# EasyEDA Pro project 单轴带屏幕.eprj, schematic 原理图
Board Name: 南塘; Create Date: 2024-04-22; Page Name: 主控MCU; Project Name: 单轴带屏幕; Schematic Name: 原理图; Update Date: 2025-10-31; Company: 嘉立创EDA; Page Size: A3; Version: V1.0
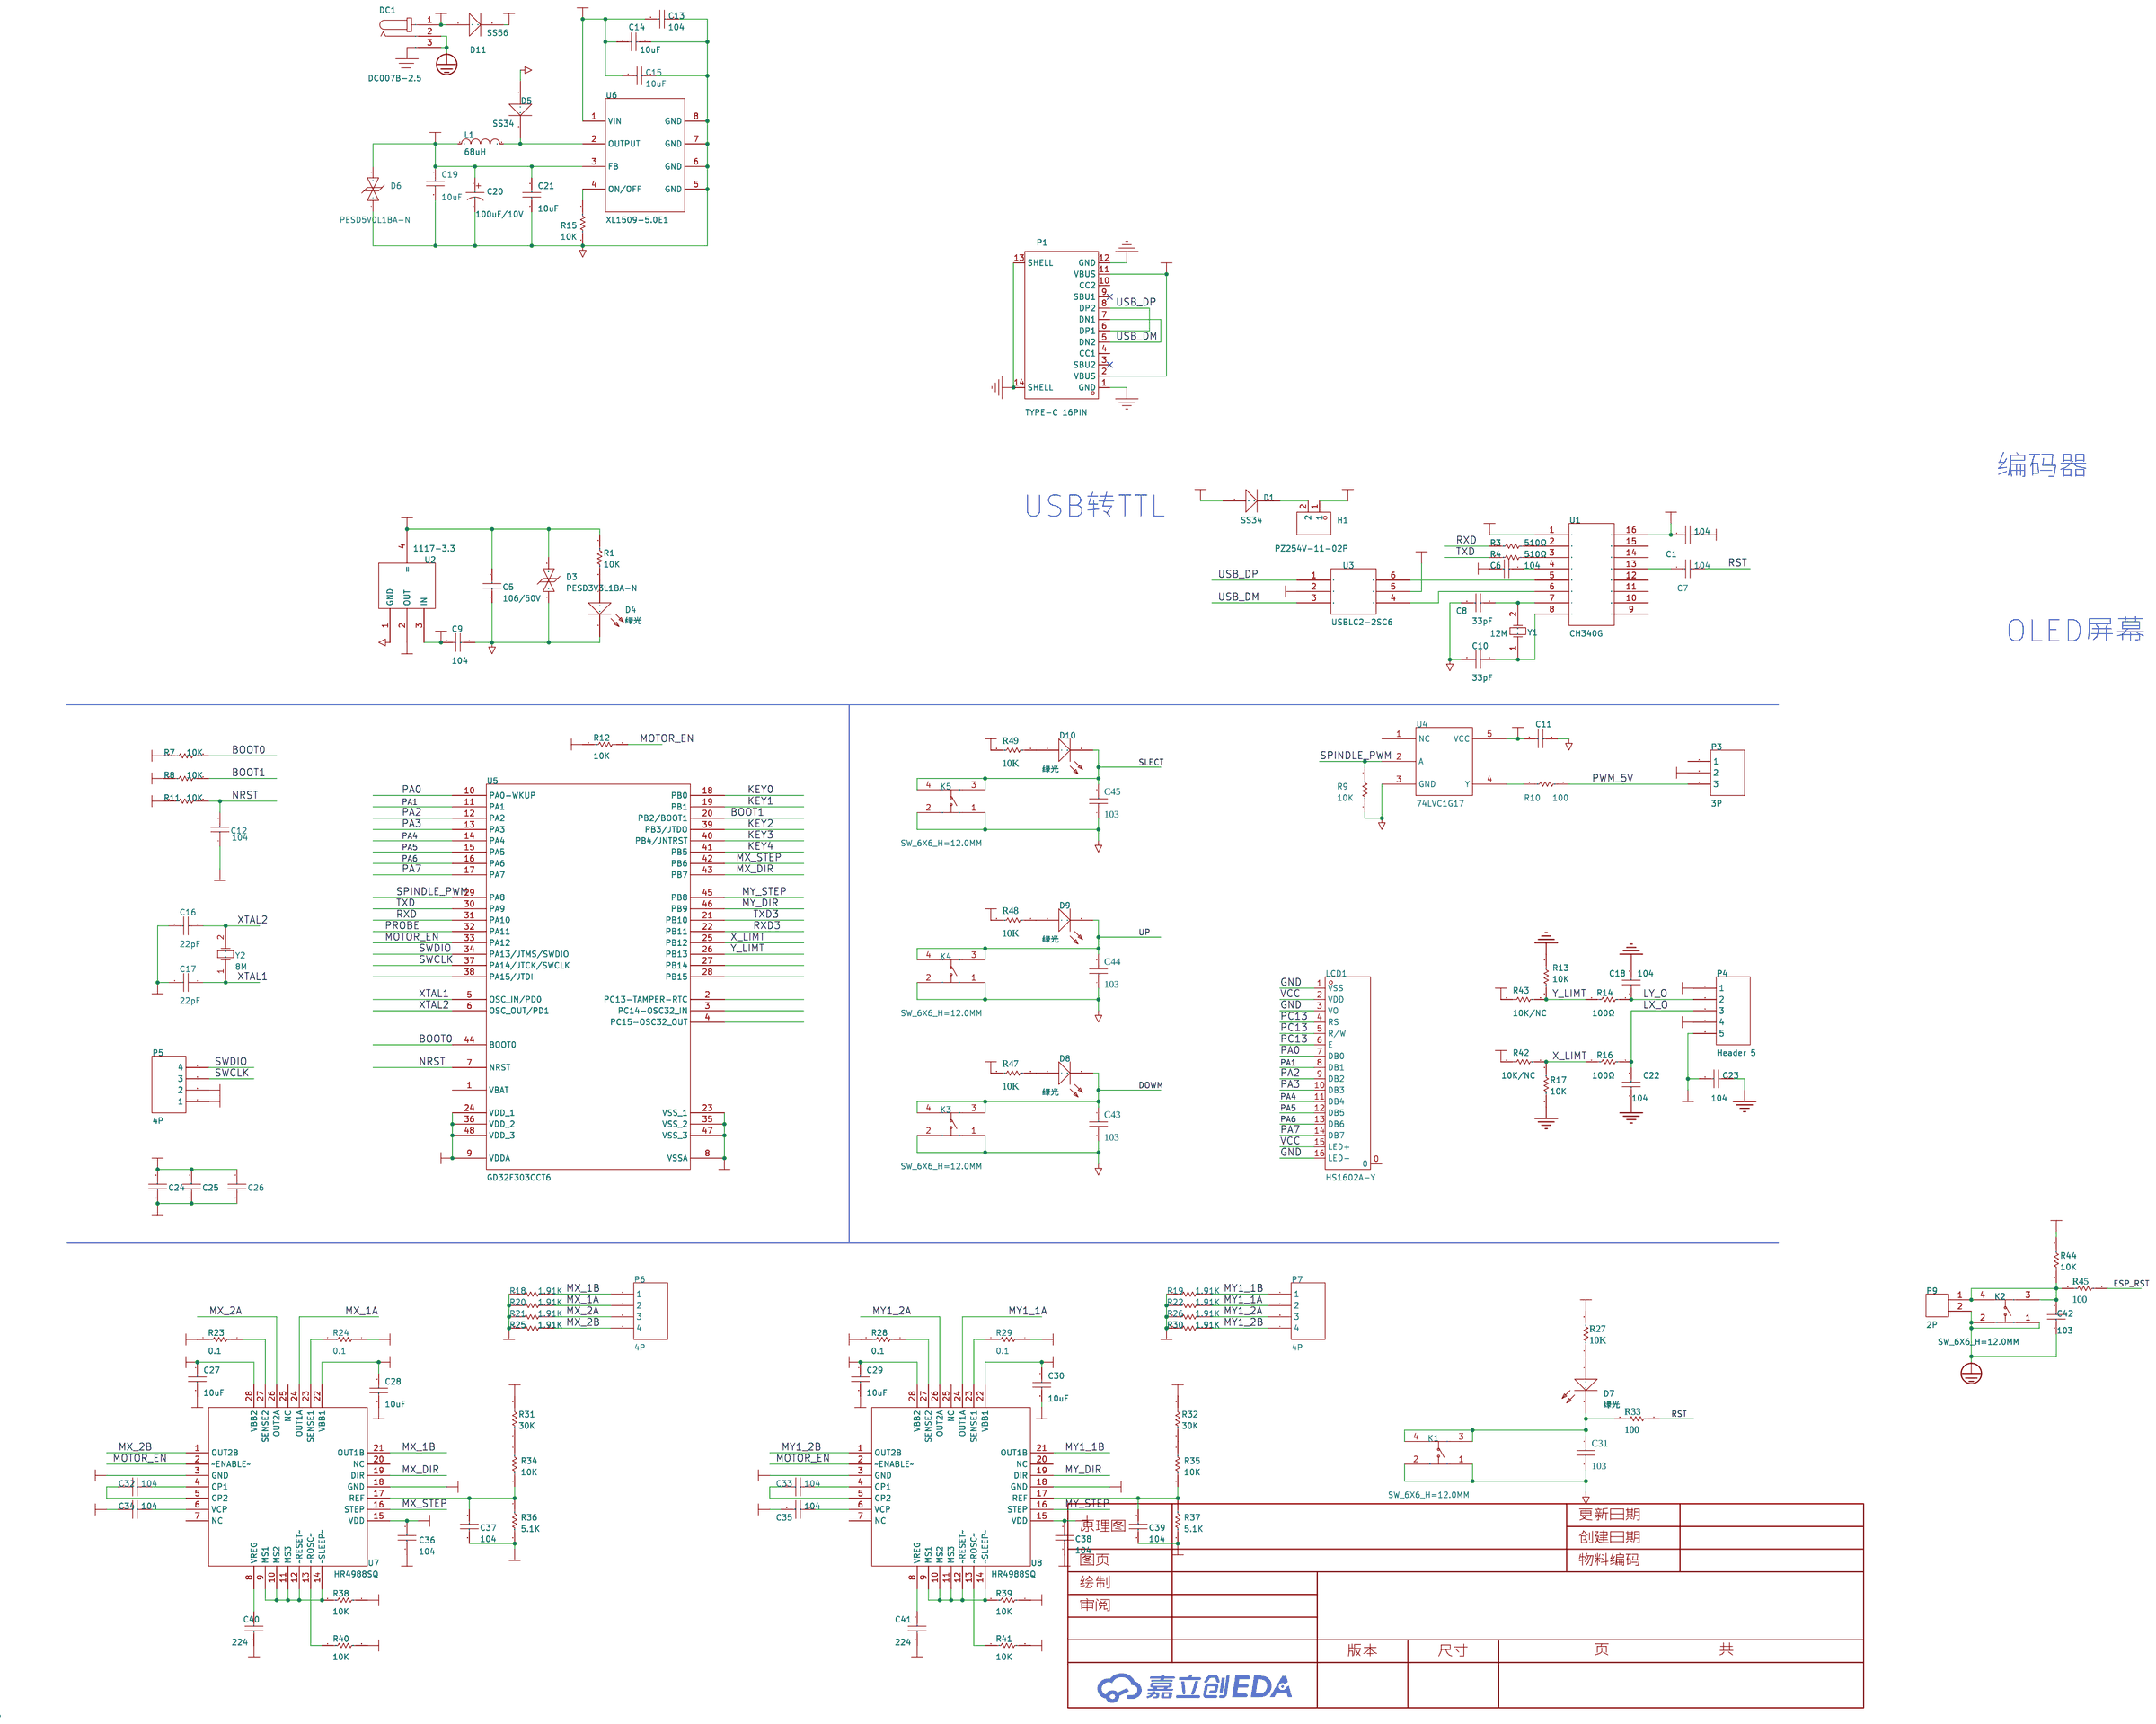
[diagram p0: schematic sheet]

## Parts
C1  104  [0603C]
C5  106/50V  [1206C]
C6  104  [0603C]
C7  104  [0603C]
C8  18pF  [0603C]
C9  104  [0603C]
C10  18pF  [0603C]
C11  104  [0603C]
C12  104  [0603C]
C13  104  [0603C]
C14  10uF  [C1206]
C15  10uF  [C1206]
C16  100pF  [0603C]
C17  100pF  [0603C]
C18  104  [0603C]
C19  10uF  [C1206]
C20  100uF/10V  [CAP-SMD_BD5.0-L5.3-W5.3-RD]
C21  10uF  [C1206]
C22  104  [0603C]
C23  104  [0603C]
C24  104  [0603C]
C25  104  [0603C]
C26  104  [0603C]
C27  10uF  [C1206]
C28  10uF  [C1206]
C29  10uF  [C1206]
C30  10uF  [C1206]
C31  103  [0603C]
C32  104  [0603C]
C33  104  [0603C]
C34  104  [0603C]
C35  104  [0603C]
C36  104  [0603C]
C37  104  [0603C]
C38  104  [0603C]
C39  104  [0603C]
C40  224  [0603C]
C41  224  [0603C]
C42  103  [11]
C43  103  [0603C]
C44  103  [0603C]
C45  103  [0603C]
D1  SS34  [SMA]
D3  PESD3V3L1BA-N  [SOD-323_L1.8-W1.3-LS2.5-BI]
D4  绿光  [0603LED]
D5  SS34  [SMA]
D6  PESD5V0L1BA-N  [SOD-323_L1.8-W1.3-LS2.5-BI]
D7  绿光  [0603LED]
D8  绿光  [0603LED]
D9  绿光  [0603LED]
D10  绿光  [0603LED]
D11  SS56  [SMA]
DC1  DC007B-2.5  [DC-IN-TH_HX-DC007B-2.5]
H1  PZ254V-11-02P  [HDR-TH_2P-P2.54-V-M]
K1  SW_6X6_H=12.0MM  [KEY-SMD_4P-L6.0-W6.0-P4.50-LS9.0]
K2  SW_6X6_H=12.0MM  [KEY-SMD_4P-L6.0-W6.0-P4.50-LS9.0]
K3  SW_6X6_H=12.0MM  [KEY-SMD_4P-L6.0-W6.0-P4.50-LS9.0]
K4  SW_6X6_H=12.0MM  [KEY-SMD_4P-L6.0-W6.0-P4.50-LS9.0]
K5  SW_6X6_H=12.0MM  [KEY-SMD_4P-L6.0-W6.0-P4.50-LS9.0]
L1  68uH  [IND-SMD_L7.0-W7.0_SMDRI74-330MT]
LCD1  HS1602A-Y  [LCD1602]
P1  TYPE-C 16PIN  [USB-C-SMD_TYPE-C-6PIN-2MD-073]
P3  3P  [HDR1X3_CON]
P4  Header 5  [HDR1X5_CON]
P5  4P  [SIP4]
P6  4P  [HDR1X4_CON]
P7  4P  [HDR1X4_CON]
P9  2P  [HDR1X2_CON]
R1  10K  [0603R]
R3  510Ω  [0603R]
R4  510Ω  [0603R]
R7  10K  [0603R]
R8  10K  [0603R]
R9  10K  [0603R]
R10  100  [0603R]
R11  10K  [0603R]
R12  10K  [0603R]
R13  10K  [0603R]
R14  100Ω  [0603R]
R15  10K  [0603R]
R16  100Ω  [0603R]
R17  10K  [0603R]
R18  1.91K  [1206R]
R19  1.91K  [1206R]
R20  1.91K  [1206R]
R21  1.91K  [1206R]
R22  1.91K  [1206R]
R23  0.1  [1206R]
R24  0.1  [1206R]
R25  1.91K  [1206R]
R26  1.91K  [1206R]
R27  10K  [0603R]
R28  0.1  [1206R]
R29  0.1  [1206R]
R30  1.91K  [1206R]
R31  10K  [0603R]
R32  10K  [0603R]
R33  100  [0603R]
R34  10K  [0603R]
R35  10K  [0603R]
R36  10K  [0603R]
R37  10K  [0603R]
R38  10K  [0603R]
R39  10K  [0603R]
R40  10K  [0603R]
R41  10K  [0603R]
R42  10K  [0603R]
R43  10K  [0603R]
R44  10K  [0603R]
R45  100  [0603R]
R47  10K  [0603R]
R48  10K  [0603R]
R49  10K  [0603R]
U1  CH340G  [SOP16]
U2  1117-3.3  [SOT-223]
U3  USBLC2-2SC6  [SOT-23-6]
U4  74LVC1G17  [SOT-23-5]
U5  GD32F303CCT6  [LQFP48]
U6  XL1509-5.0E1  [ESOP-8_L4.9-W3.9-P1.27-LS6.0-BL-EP]
U7  HR4988SQ  [QFN28]
U8  HR4988SQ  [QFN28]
Y1  12M  [晶振贴片49SSMD]
Y2  8M  [晶振贴片]

## Library data of the parts
C1 C6 C7 C9 C12 C13 = 104: Capacitor (Semiconductor SIM Model); Published: 8-Jun-2000; LatestRevisionDate: 17-Jul-2002; LatestRevisionNote: Re-released for DXP Platform.; PackageReference: C1206; Publisher: Altium Limited; Origin Footprint 2: C1206; Origin Footprint 3: 0402; Origin Footprint 4: 1310[0504]; Origin Footprint 5: 1608[0603]; Origin Footprint 6: C1210; Origin Footprint 7: C0805; Origin Footprint 8: C1206; Origin Footprint 9: 0805; Origin Footprint 10: 0805L; Origin Footprint 11: 0805C; Design Item ID: Cap Semi; Library Name: Miscellaneous Devices
C5 = 106/50V: Capacitor (Semiconductor SIM Model); Published: 8-Jun-2000; LatestRevisionDate: 17-Jul-2002; LatestRevisionNote: Re-released for DXP Platform.; PackageReference: C1206; Publisher: Altium Limited; Origin Footprint 2: C1206; Origin Footprint 3: 0402; Origin Footprint 4: 1310[0504]; Origin Footprint 5: 1608[0603]; Origin Footprint 6: C1210; Origin Footprint 7: C0805; Origin Footprint 8: C1206; Origin Footprint 9: 0805; Origin Footprint 10: 0805L; Design Item ID: Cap Semi; Library Name: Miscellaneous Devices
C8 C10 = 33pF: Capacitor (Semiconductor SIM Model); Published: 8-Jun-2000; LatestRevisionDate: 17-Jul-2002; LatestRevisionNote: Re-released for DXP Platform.; PackageReference: C1206; Publisher: Altium Limited; Origin Footprint 2: C1206; Origin Footprint 3: 0402; Origin Footprint 4: 1310[0504]; Origin Footprint 5: 1608[0603]; Origin Footprint 6: C1210; Origin Footprint 7: C0805; Origin Footprint 8: C1206; Origin Footprint 9: 0805; Origin Footprint 10: 0805L; Design Item ID: Cap Semi; Library Name: Miscellaneous Devices
C11 C18 C22-C26 C32-C39 = 104: Origin Footprint 2: CAP; Origin Footprint 3: 0805C; Design Item ID: CAP; Library Name: SCH封装库
C14 C15 C19 C21 C27-C30 = 104: Design Item ID: CAP; Library Name: SCH--װ--
C16 C17 = 22pF: Capacitor (Semiconductor SIM Model); Published: 8-Jun-2000; LatestRevisionDate: 17-Jul-2002; LatestRevisionNote: Re-released for DXP Platform.; PackageReference: C1206; Publisher: Altium Limited; Origin Footprint 2: C1206; Origin Footprint 3: 0402; Origin Footprint 4: 1310[0504]; Origin Footprint 5: 1608[0603]; Origin Footprint 6: C1210; Origin Footprint 7: C0805; Origin Footprint 8: C1206; Origin Footprint 9: 0805; Origin Footprint 10: 0805L; Origin Footprint 11: 0805C; Design Item ID: Cap Semi; Library Name: Miscellaneous Devices
C20 = CS1A101M-CRD54: 容值:100uF;精度:±20%;额定电压:10V;电容体直径:5mm;电容体长度:5.4mm;纹波电流:-;等效串联电阻:-;工作寿命:1000hrs@105℃;工作温度:-40℃~+105℃;; LCSC Part Name: 100uF ±20% 10V; Supplier Part: C96182; Manufacturer: ST(先科); Supplier Footprint: SMD,5x5.4mm; JLCPCB Part Class: Extended Part; Datasheet: https://atta.szlcsc.com/upload/public/pdf/source/20170304/1488621207726.pdf; Supplier: LCSC; Tolerance: ±20%; Rated Voltage: 10V; φD: 5mm; L: 5.4mm; Lifetime @ Temp: 1000hrs@105℃; Operating Temperature: -40℃~+105℃
C31 C43-C45 = 103: Design Item ID: CAP; Library Name: SCH--װ--
C40 C41 = 224: Design Item ID: CAP; Library Name: SCH封装库
C42 = 103: Design Item ID: CAP; Library Name: SCH封装库
D1 D11 = SS56: Design Item ID: 1N4148; Library Name: SCH封装库
D3 D6 = PESD5V0S1BBN: 极性:Bidirectional;反向关断电压（典型值）:5V (Max);击穿电压（最小值）:6V;箝位电压:15V;峰值脉冲电流（10/1000us）:5A (8/20us);; Supplier Part: C314264; Manufacturer: BORN伯恩半导体; Supplier Footprint: SOD-523; JLCPCB Part Class: Extended Part; Datasheet: https://atta.szlcsc.com/upload/public/pdf/source/20181015/C314264_F9AC5761AC2631DA841FBD1D9C6821E3.pdf; Supplier: LCSC; Polarity: Bidirectional; Voltage - Reverse Standoff (Typ): 5V (Max); Voltage - Breakdown (Min): 6V; Voltage - Clamping (Max) @ Ipp: 15V; Current - Peak Pulse (10/1000μs): 5A (8/20us)
D4 D7-D10 = 红光: Origin Footprint 2: LED(小); Design Item ID: LED; Library Name: SCH封装库
D5 = SS56: Design Item ID: 1N4148; Library Name: SCH--װ--
DC1 = DC007B-2.5: 连接器类型:DC电源插座;安装方式:弯插;触点内径:2.5mm;触点外径:7.7mm;额定电流:5A;额定电压:20V;工作温度:-25℃~+70℃;; LCSC Part Name: DC电源插座 内径:2.5mm 外径:7.7mm; Supplier Part: C17701685; Manufacturer: SHOU HAN(首韩); Supplier Footprint: 插件; JLCPCB Part Class: 扩展库; Datasheet: https://atta.szlcsc.com/upload/public/pdf/source/20230912/B85EC3863CDA4EDD9FBFF38F4F2C356A.pdf; Supplier: LCSC; Connector Type: DC电源插座; Mounting Type: 弯插; Inside Contact Diameter: 2.5mm; Outside Contact Diameter: 7.7mm; Current Rating: 5A; Voltage Rating (Max): 20V; Operating Temperature: -25℃~+70℃
H1 = PZ254V-11-02P: 插针结构:1x2P;间距:2.54mm;行距:-;圆针/方针:方针;安装类型:直插;排数:单排;总PIN位数:2P;额定电流:-;额定电压:-;配合针长度:6mm;塑高:2.5mm;端接针长度:3mm;触头材质:黄铜;触头镀层:-;工作温度范围:-40℃~+105℃;颜色:黑色;; LCSC Part Name: 间距:2.54mm 1x2P 直插 方针; Supplier Part: C492401; Manufacturer: XFCN(兴飞); Supplier Footprint: 插件,P=2.54mm; JLCPCB Part Class: 扩展库; Datasheet: https://atta.szlcsc.com/upload/public/pdf/source/20200309/C492401_A812433581A9B211A7FFA413ADDFF0E5.pdf; Supplier: LCSC; Pin Structure: 1x2P; Pitch: 2.54mm; Circluar Pins/Square Pins: 方针; Mounting Type: 直插; Number of Rows: 单排; Number of Pins: 2P; Length of Mating Pin: 6mm; Insulation Height: 2.5mm; Length of End Connection Pin: 3mm; Contact Material: 黄铜; Operating Temperature Range: -40℃~+105℃; Color: 黑色
K1-K5 = SW_6X6_H=12.0MM: Supplier Part: C9900018802; Supplier Footprint: KEY-SMD; JLCPCB Part Class: 扩展库; Supplier: LCSC
L1 = SMDRI74-330MT: 电感值:33uH;精度:±20%;额定电流:960mA;饱和电流(Isat):1.8A;类型:屏蔽电感;; LCSC Part Name: 33uH±20%1.8A; Supplier Part: C49625; Manufacturer: SXN(顺翔诺); Supplier Footprint: SMD,7.5x7.5mm; JLCPCB Part Class: 扩展库; Datasheet: https://atta.szlcsc.com/upload/public/pdf/source/20210810/6F96FDC19AA308DD2AD166FFB9640E87.pdf; Supplier: LCSC; Tolerance: ±20%; Rated Current: 960mA; Saturation Current (Isat): 1.8A; DC Resistance (DCR): 170mΩ; Type: 屏蔽电感
LCD1 = HS1602A-Y: LCSC Part Name: 2寸16x2字符型8位通讯单色LCD液晶显示模组黄绿屏; Supplier Part: C18198250; Manufacturer: HS(汉昇); JLCPCB Part Class: 扩展库; Datasheet: https://atta.szlcsc.com/upload/public/pdf/source/20230921/41ABF4C08C578F5401713169C9FD3309.pdf; Supplier: LCSC; Main Control Chip: SPLC780; Size: 2; Operating Temperature: -20℃~+70℃
P1 = TYPE-C 16PIN 2MD(073): 连接器类型:Type-C;标准:-;公母:母;端口数量:1;触点数量:16P;安装方式:卧贴;额定电流 - 电源:5A;工作温度范围:-25℃~+85℃;; LCSC Part Name: Type-C 母 卧贴; Supplier Part: C2765186; Manufacturer: SHOU HAN(首韩); Supplier Footprint: SMD; JLCPCB Part Class: Extended Part; Datasheet: https://atta.szlcsc.com/upload/public/pdf/source/20211123/39B17C16241EAC15C5E277BDA434118E.pdf; Supplier: LCSC; Connector Type: Type-C; Gender: 母; Number of Ports: 1; Number of Contacts: 16P; Mounting Style: 卧贴; Current Rating - Power (Max): 5A; Operating Temperature Range: -25℃~+85℃
P3 = 3P: Library Name: SCH封装库
P4 = Header 5: Header, 5-Pin; LatestRevisionDate: 17-Jul-2002; LatestRevisionNote: Re-released for DXP Platform.; Publisher: Altium Limited; Library Name: Miscellaneous Connectors
P5-P7 = 4P: Library Name: SCH封装库
P9 = 2P: Library Name: SCH--װ--
R1 R14 R16 = 2K: Resistor; Published: 8-Jun-2000; LatestRevisionDate: 17-Jul-2002; LatestRevisionNote: Re-released for DXP Platform.; PackageReference: AXIAL-0.3; Publisher: Altium Limited; Origin Footprint 2: AXIAL-0.3; Origin Footprint 3: R0805; Origin Footprint 4: 0805R; Design Item ID: RES; Library Name: SCH封装库
R3 R4 R10 = 100: Resistor; Published: 8-Jun-2000; LatestRevisionDate: 17-Jul-2002; LatestRevisionNote: Re-released for DXP Platform.; PackageReference: AXIAL-0.3; Publisher: Altium Limited; Origin Footprint 2: AXIAL-0.3; Origin Footprint 3: R0805; Origin Footprint 4: 0805R; Design Item ID: RES; Library Name: SCH封装库
R7 R8 R11 = 10k: Resistor; Published: 8-Jun-2000; LatestRevisionDate: 17-Jul-2002; LatestRevisionNote: Re-released for DXP Platform.; PackageReference: AXIAL-0.3; Publisher: Altium Limited; Origin Footprint 2: AXIAL-0.3; Origin Footprint 3: 0805R; Origin Footprint 4: 0805R; Design Item ID: RES; Library Name: SCH封装库
R9 R27 R47-R49 = 10K: Resistor; Published: 8-Jun-2000; LatestRevisionDate: 17-Jul-2002; LatestRevisionNote: Re-released for DXP Platform.; PackageReference: AXIAL-0.3; Publisher: Altium Limited; Origin Footprint 2: AXIAL-0.3; Origin Footprint 3: R0805; Origin Footprint 4: 0805R; Design Item ID: RES; Library Name: SCH--װ--
R12 R13 R15 R17 R31 R32 R34-R39 R42 R43 = 10k: Resistor; Published: 8-Jun-2000; LatestRevisionDate: 17-Jul-2002; LatestRevisionNote: Re-released for DXP Platform.; PackageReference: AXIAL-0.3; Publisher: Altium Limited; Origin Footprint 2: AXIAL-0.3; Origin Footprint 3: R0805; Origin Footprint 4: 0805R; Design Item ID: RES; Library Name: SCH封装库
R18-R22 R25 R26 R30 = 1.91K: Resistor; Published: 8-Jun-2000; LatestRevisionDate: 17-Jul-2002; LatestRevisionNote: Re-released for DXP Platform.; PackageReference: AXIAL-0.3; Publisher: Altium Limited; Origin Footprint 2: AXIAL-0.3; Origin Footprint 3: R0805; Origin Footprint 4: 0805R; Design Item ID: RES; Library Name: SCH封装库
R23 R24 R28 R29 = 0.1: Resistor; Published: 8-Jun-2000; LatestRevisionDate: 17-Jul-2002; LatestRevisionNote: Re-released for DXP Platform.; PackageReference: AXIAL-0.3; Publisher: Altium Limited; Origin Footprint 2: AXIAL-0.3; Origin Footprint 3: R0805; Origin Footprint 4: 0603R; Design Item ID: RES; Library Name: SCH封装库
R33 R45 = 100: Resistor; Published: 8-Jun-2000; LatestRevisionDate: 17-Jul-2002; LatestRevisionNote: Re-released for DXP Platform.; PackageReference: AXIAL-0.3; Publisher: Altium Limited; Origin Footprint 2: AXIAL-0.3; Origin Footprint 3: R0805; Origin Footprint 4: 0805R; Design Item ID: RES; Library Name: SCH--װ--
R40 R41 = 10k: Resistor; Published: 8-Jun-2000; LatestRevisionDate: 17-Jul-2002; LatestRevisionNote: Re-released for DXP Platform.; PackageReference: AXIAL-0.3; Publisher: Altium Limited; Origin Footprint 2: AXIAL-0.3; Origin Footprint 3: R0805; Design Item ID: RES; Library Name: SCH封装库
R44 = 10K: Resistor; Published: 8-Jun-2000; LatestRevisionDate: 17-Jul-2002; LatestRevisionNote: Re-released for DXP Platform.; PackageReference: AXIAL-0.3; Publisher: Altium Limited; Origin Footprint 2: AXIAL-0.3; Origin Footprint 3: R0805; Origin Footprint 4: 0805R; Design Item ID: RES; Library Name: SCH封装库
U1 = CH340G: Design Item ID: DIP16; Library Name: SCH封装库
U2 = 1117-3.3: Design Item ID: LM1117; Library Name: Party600
U3 = USBLC2-2SC6: Design Item ID: DIP6; Library Name: SCH封装库
U4 = 74LVC1G04: Library Name: SCH--װ--
U5 = STM32F103C8T6/CBT6: STM32 ARM-based 32-bit MCU with 32 Kbytes Flash, 48-pin LQFP, Industrial Temperature; Published: *; DatasheetVersion: *; PackageVersion: *; PackageReference: *; Publisher: *; PackageDescription: *; ComponentLink1Description: *; ComponentLink1URL: *; ComponentLink2Description: *; ComponentLink2URL: *; Origin Footprint 2: LQFP48_L; Origin Footprint 3: LQFP48_M; Design Item ID: STM32F103C6T6; Library Name: ST Microcontroller 32-Bit STM32 SCH
U6 = XL1509-5.0E1: 功能类型:降压型;同步整流:-;输出通道数:-;拓扑结构:-;输入电压:-;输出电流(最大值):-;开关频率:-;; LCSC Part Name: 降压型; Supplier Part: C61063; Manufacturer: XLSEMI(芯龙); Supplier Footprint: SOP-8_150mil; JLCPCB Part Class: Basic Part; Datasheet: https://atta.szlcsc.com/upload/public/pdf/source/20151020/1457707483545.pdf; Supplier: LCSC; Function: 降压型
U7 U8 = HR4988SQ: Design Item ID: HR4988; Library Name: SCH封装库
Y1 = 12M: Crystal Oscillator; Published: 8-Jun-2000; LatestRevisionDate: 17-Jul-2002; LatestRevisionNote: Re-released for DXP Platform.; PackageReference: R38; Publisher: Altium Limited; Origin Footprint 2: R38; Origin Footprint 3: XTAL-49S; Design Item ID: XTAL; Library Name: Miscellaneous Devices
Y2 = 8M: Crystal Oscillator; Published: 8-Jun-2000; LatestRevisionDate: 17-Jul-2002; LatestRevisionNote: Re-released for DXP Platform.; PackageReference: R38; Publisher: Altium Limited; Origin Footprint 2: R38; Origin Footprint 3: XTAL-49S; Design Item ID: XTAL; Library Name: Miscellaneous Devices

## Nets
3V3: C5.1 C24.2 C25.2 C26.2 D3.2 P5.2 R1.1 R11.1 R12.2 R27.2 R42.2 R43.1 R44.1 R47.2 R48.2 R49.2 U2.2(OUT) U2.4(=) U5.9(VDDA) U5.24(VDD_1) U5.36(VDD_2) U5.48(VDD_3)
24V: C13.2 C14.1 C15.2 D11.2 U6.1(VIN)
GND: C1.2 C5.2 C6.2 C8.2 C9.1 C10.2 C11.1 C12.1 C13.1 C14.2 C15.1 C16.2 C17.2 C18.2 C19.2 C20.2 C21.2 C22.1 C23.1 C24.1 C25.1 C26.1 C27.2 C28.2 C29.2 C30.2 C31.1 C36.2 C37.2 C38.2 C39.2 C40.2 C41.2 C42.1 C43.1 C44.1 C45.1 D3.1 D4.2 D5.1 D6.1 DC1.2 DC1.3 K1.1 K1.2 K2.1 K2.2 K3.1 K3.2 K4.1 K4.2 K5.1 K5.2 LCD1.1(VSS) LCD1.3(VO) LCD1.16(LED-) P1.1(GND) P1.12(GND) P1.13(SHELL) P1.14(SHELL) P3.2 P4.1 P4.4 P5.1 P9.2 R7.1 R8.1 R9.2 R13.1 R15.2 R17.2 R18.2 R19.2 R20.2 R21.2 R22.2 R23.2 R24.1 R25.2 R26.2 R28.2 R29.1 R30.2 R36.2 R37.2 R40.2 R41.2 U1.1 U2.1(GND) U3.2 U4.3(GND) U5.8(VSSA) U5.23(VSS_1) U5.35(VSS_2) U5.47(VSS_3) U6.5(GND) U6.6(GND) U6.7(GND) U6.8(GND) U7.3(GND) U7.18(GND) U8.3(GND) U8.18(GND)
VCC: C1.1 C9.2 C11.2 C19.1 C20.1 C21.1 C23.2 C36.1 C38.1 D6.2 H1.1 L1.1 LCD1.2(VDD) LCD1.15(LED+) P4.5 R31.2 R32.2 R38.1 R39.1 U1.16 U2.3(IN) U4.5(VCC) U6.3(FB) U7.15(VDD) U8.15(VDD)
VIN_24: D11.1 DC1.1
BOOT0: R7.2 U5.44(BOOT0)
BOOT1: R8.2 U5.20(PB2/BOOT1)
DOWM: C43.2 D8.2 K3.3 K3.4
ESP_RST: R45.1
KEY0: U5.18(PB0)
KEY1: U5.19(PB1)
KEY2: U5.39(PB3/JTDO)
KEY3: U5.40(PB4/JNTRST)
KEY4: U5.41(PB5)
LX_O: C22.2 P4.3 R16.1
LY_O: C18.1 P4.2 R14.1
MOTOR_EN: R12.1 U5.33(PA12) U7.2(~ENABLE~) U8.2(~ENABLE~)
MX_1A: P6.2 R20.1 U7.24(OUT1A)
MX_1B: P6.1 R18.1 U7.21(OUT1B)
MX_2A: P6.3 R21.1 U7.26(OUT2A)
MX_2B: P6.4 R25.1 U7.1(OUT2B)
MX_DIR: U5.43(PB7) U7.19(DIR)
MX_STEP: U5.42(PB6) U7.16(STEP)
MY1_1A: P7.2 R22.1 U8.24(OUT1A)
MY1_1B: P7.1 R19.1 U8.21(OUT1B)
MY1_2A: P7.3 R26.1 U8.26(OUT2A)
MY1_2B: P7.4 R30.1 U8.1(OUT2B)
MY_DIR: U5.46(PB9) U8.19(DIR)
MY_STEP: U5.45(PB8) U8.16(STEP)
NRST: C12.2 R11.2 U5.7(NRST)
PA0: LCD1.7(DB0) U5.10(PA0-WKUP)
PA1: LCD1.8(DB1) U5.11(PA1)
PA2: LCD1.9(DB2) U5.12(PA2)
PA3: LCD1.10(DB3) U5.13(PA3)
PA4: LCD1.11(DB4) U5.14(PA4)
PA5: LCD1.12(DB5) U5.15(PA5)
PA6: LCD1.13(DB6) U5.16(PA6)
PA7: LCD1.14(DB7) U5.17(PA7)
PC13: LCD1.4(RS) LCD1.5(R/W) LCD1.6(E)
PROBE: U5.32(PA11)
PWM_5V: P3.3 R10.1
RST: C7.2 R33.1
RXD: R3.2 U5.31(PA10)
RXD3: U5.22(PB11)
SLECT: C45.2 D10.2 K5.3 K5.4
SPINDLE_PWM: R9.1 U4.2(A) U5.29(PA8)
SWCLK: P5.3 U5.37(PA14/JTCK/SWCLK)
SWDIO: P5.4 U5.34(PA13/JTMS/SWDIO)
TXD: R4.2 U5.30(PA9)
TXD3: U5.21(PB10)
UP: C44.2 D9.2 K4.3 K4.4
USB_DM: P1.5(DN2) P1.7(DN1) U3.3
USB_DP: P1.6(DP1) P1.8(DP2) U3.1
VM: C27.1 C28.1 C29.1 C30.1 C34.2 C35.2 U7.22(VBB1) U7.28(VBB2) U8.22(VBB1) U8.28(VBB2)
VUSB: D1.1 P1.2(VBUS) P1.11(VBUS) U3.5
X_LIMT: R16.2 R17.1 R42.1 U5.25(PB12)
XTAL1: C17.1 U5.5(OSC_IN/PD0) Y2.1(OSC1)
XTAL2: C16.1 U5.6(OSC_OUT/PD1) Y2.2(OSC2)
Y_LIMT: R13.2 R14.2 R43.2 U5.26(PB13)
$1N85912: C32.2 U7.5(CP2)
$1N85916: C32.1 U7.4(CP1)
$1N85918: C34.1 U7.6(VCP)
$1N85922: C40.1 U7.8(VREG)
$1N85924: R40.1 U7.13(~ROSC~)
$1N85949: R24.2 U7.23(SENSE1)
$1N85962: R23.1 U7.27(SENSE2)
$1N85980: C33.2 U8.5(CP2)
$1N85984: C33.1 U8.4(CP1)
$1N85986: C35.1 U8.6(VCP)
$1N85990: C41.1 U8.8(VREG)
$1N85992: R41.1 U8.13(~ROSC~)
$1N86002: C39.1 R35.2 R37.1 U8.17(REF)
$1N86020: R29.2 U8.23(SENSE1)
$1N86033: R28.1 U8.27(SENSE2)
$1N86106: R38.2 U7.9(MS1) U7.10(MS2) U7.11(MS3) U7.12(~RESET~) U7.14(~SLEEP~)
$1N86116: R39.2 U8.9(MS1) U8.10(MS2) U8.11(MS3) U8.12(~RESET~) U8.14(~SLEEP~)
$1N86149: C6.1 U1.4
$1N86156: C7.1 U1.13
$1N86170: U1.5 U3.6
$1N86179: U1.6 U3.4
$1N86183: C8.1 U1.7 Y1.2(OSC2)
$1N86186: C10.1 U1.8 Y1.1(OSC1)
$1N86190: R10.2 U4.4(Y)
$1N86264: D4.1 R1.2
$1N86304: R3.1 U1.2
$1N86306: R4.1 U1.3
$1N86352: C31.2 D7.2 K1.3 K1.4 R33.2
$1N86386: D7.1 R27.1
$1N86869: D5.2 L1.2 U6.2(OUTPUT)
$1N86871: R15.1 U6.4(ON/OFF)
$1N92113: R31.1 R34.1
$1N92147: C37.1 R34.2 R36.1 U7.17(REF)
$1N92216: R32.1 R35.1
Net-(C42-2): C42.2 K2.3 K2.4 P9.1 R44.2 R45.2
Net-(D1-2): D1.2 H1.2
Net-(D8-1): D8.1 R47.1
Net-(D9-1): D9.1 R48.1
Net-(D10-1): D10.1 R49.1

Not connected (* = marked no-connect by the designer): LCD1 0; P1 3(SBU2)* 4(CC1) 9(SBU1)* 10(CC2); P3 1; U1 9 10 11 12 14 15; U4 1(NC); U5 1(VBAT) 2(PC13-TAMPER-RTC) 3(PC14-OSC32_IN) 4(PC15-OSC32_OUT) 27(PB14) 28(PB15) 38(PA15/JTDI); U7 7(NC) 20(NC) 25(NC); U8 7(NC) 20(NC) 25(NC)

## Notes on the sheet
- 编码器
- USB转TTL
- OLED屏幕
